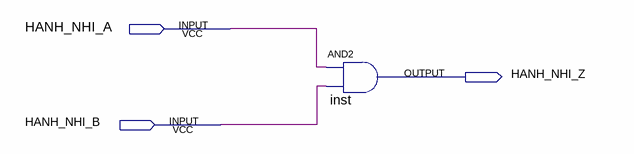
[diagram p0: schematic sheet]
// Quartus schematic Assignment3.bdf as structural Verilog: 1 symbols, 3 pins
module Assignment3 (
  input  HANH_NHI_A,
  input  HANH_NHI_B,
  output HANH_NHI_Z
);

  and inst (HANH_NHI_Z, HANH_NHI_A, HANH_NHI_B);
endmodule
